# EasyEDA schematic SCH_USB-turtle_2024-06-30 (1).json
TITLE: USB-Hub 4 ports; REV: 1.0; Date: 2024-06-29; Sheet: 1/1; Drawn By: Gabi; Company: N/A
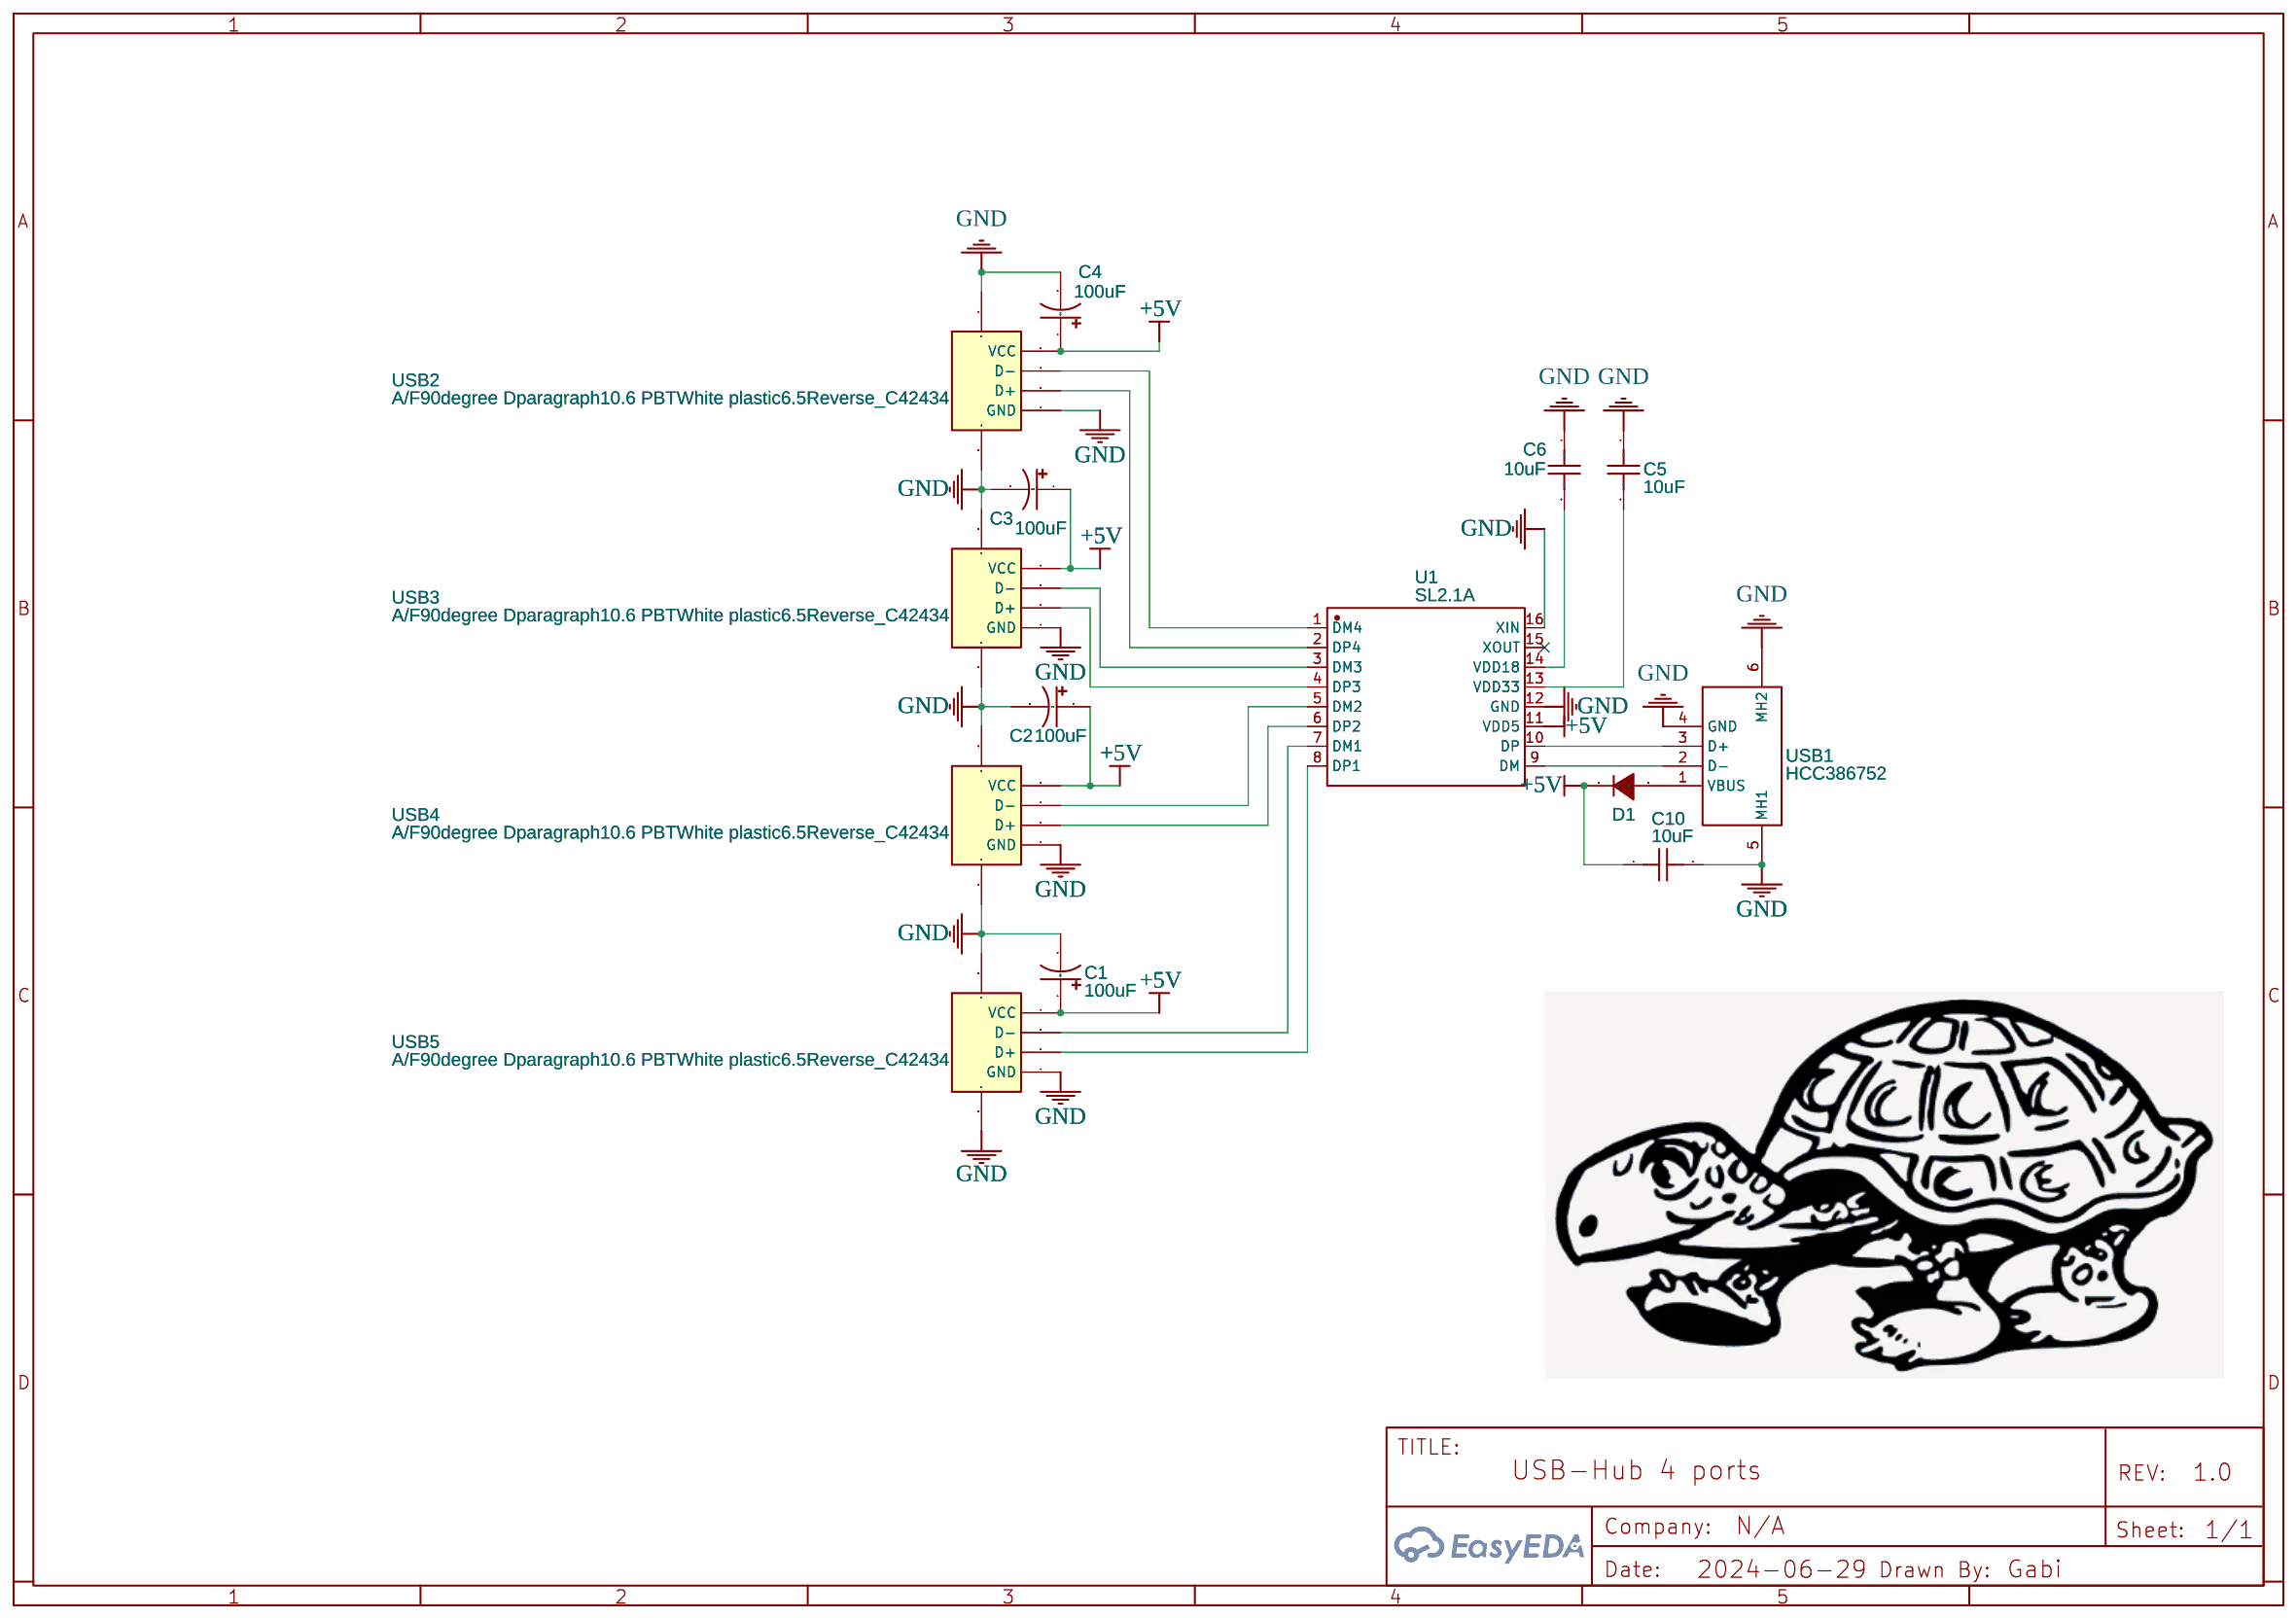
[diagram p0: schematic sheet]

## Parts
C1  100uF  [CAP-TH_BD5.0-P2.00-D0.8-FD]
C2  100uF  [CAP-TH_BD5.0-P2.00-D0.8-FD]
C3  100uF  [CAP-TH_BD5.0-P2.00-D0.8-FD]
C4  100uF  [CAP-TH_BD5.0-P2.00-D0.8-FD]
C5  10uF  [C0603]
C6  10uF  [C0603]
C10  10uF  [C0603]
D1  NSR0320MW2T1G  [SOD-323_L1.8-W1.3-LS2.5-RD]
U1  SL2.1A  [SOP-16_L10.0-W3.9-P1.27-LS6.0-BL]
USB1  HCC386752  [USB-SMD_KH-USB-AM-4P-CB_FIXED]
USB2  A/F90degree Dparagraph10.6 PBTWhite plastic6.5Reverse_C42434  [USB-A-TH_USB-M-71]
USB3  A/F90degree Dparagraph10.6 PBTWhite plastic6.5Reverse_C42434  [USB-A-TH_USB-M-71]
USB4  A/F90degree Dparagraph10.6 PBTWhite plastic6.5Reverse_C42434  [USB-A-TH_USB-M-71]
USB5  A/F90degree Dparagraph10.6 PBTWhite plastic6.5Reverse_C42434  [USB-A-TH_USB-M-71]

## Library data of the parts
C1-C4 = NXB16VB100M5*11_LO: Contributor: LCSC; Supplier: LCSC; Supplier Part: C346931; Manufacturer: SAMYOUNG(韩国三莹); Manufacturer Part: NXB16V100M5*11 LO; JLCPCB Part Class: Extended Part
C5 C6 C10 = C1608JB0J106M080AB: Contributor: lcsc; Supplier: LCSC; Supplier Part: C3876987; Manufacturer: TDK; JLCPCB Part Class: Extended Part
D1 = NSR0320MW2T1G: Supplier: LCSC; Manufacturer: onsemi(安森美); Supplier Part: C48192; JLCPCB Part Class: Extended Part
U1 = SL2.1A: Contributor: LCSC; Supplier: LCSC; Supplier Part: C192893; Manufacturer: CoreChips(和芯润德); JLCPCB Part Class: Extended Part
USB1 = HCC386752: Contributor: Penguin Kothe; Supplier: LCSC; Supplier Part: C386752; Manufacturer: Ckmtw(灿科盟); Manufacturer Part: U-USBAR04P-M003; JLCPCB Part Class: Extended Part
USB2-USB5 = A/F90degree Dparagraph10.6 PBTWhite plastic6.5Reverse_C42434: Contributor: 立创EDA官方封装库; Supplier: LCSC; Manufacturer: 精拓金; Manufacturer Part: A/F90度 D款10.6后两脚无卷边铜壳PBT白胶6.5反向; Supplier Part: C42434; JLCPCB Part Class: Extended Part

## Nets
+5V: C1.1 C2.1 C3.1 C4.1 C10.1 D1.1(C) U1.11(VDD5) USB2.1(VCC) USB3.1(VCC) USB4.1(VCC) USB5.1(VCC)
GND: C1.2 C2.2 C3.2 C4.2 C5.1 C6.1 C10.2 U1.12(GND) U1.16(XIN) USB1.4(GND) USB1.5(MH1) USB1.6(MH2) USB2.0 USB2.4(GND) USB3.0 USB3.4(GND) USB4.0 USB4.4(GND) USB5.0 USB5.4(GND)
Net-(C5-2): C5.2 U1.13(VDD33)
Net-(C6-2): C6.2 U1.14(VDD18)
Net-(D1-2): D1.2(A) USB1.1(VBUS)
Net-(U1-1): U1.1(DM4) USB2.2(D-)
Net-(U1-2): U1.2(DP4) USB2.3(D+)
Net-(U1-3): U1.3(DM3) USB3.2(D-)
Net-(U1-4): U1.4(DP3) USB3.3(D+)
Net-(U1-5): U1.5(DM2) USB4.2(D-)
Net-(U1-6): U1.6(DP2) USB4.3(D+)
Net-(U1-7): U1.7(DM1) USB5.2(D-)
Net-(U1-8): U1.8(DP1) USB5.3(D+)
Net-(U1-9): U1.9(DM) USB1.2(D-)
Net-(U1-10): U1.10(DP) USB1.3(D+)

Not connected (* = marked no-connect by the designer): U1 15(XOUT)*
